# Altium schematic sheet POWER SUPPLY.SchDoc
size A4
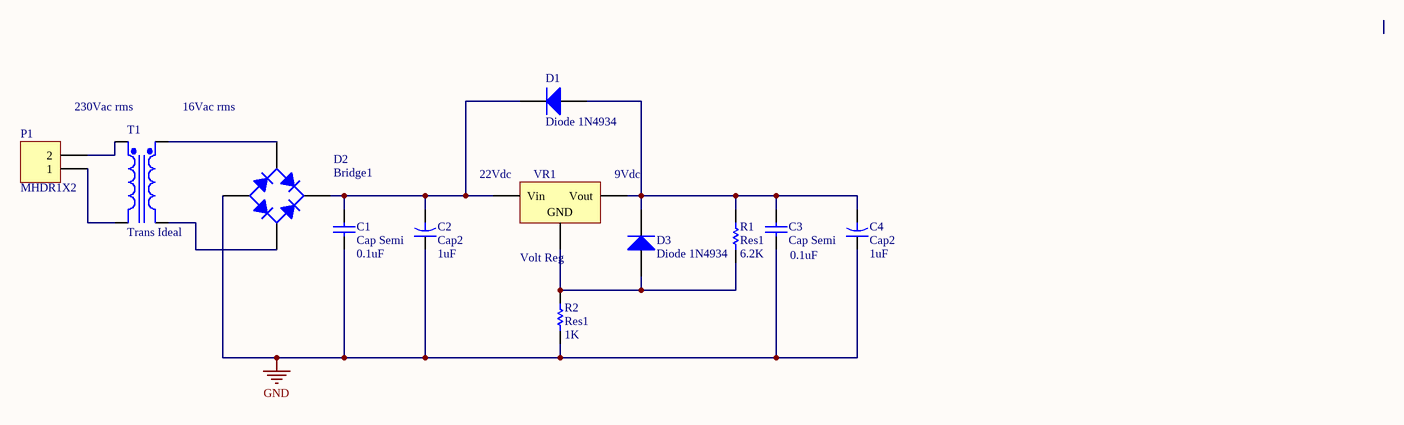
[diagram p0: POWER SUPPLY.SchDoc]

## Parts
C1  Cap Semi  value 0.1uF  [C1206]
C2  Cap2  value 1uF  [CAPR5-4X5]
C3  Cap Semi  value 0.1uF  [C1206]
C4  Cap2  value 1uF  [CAPR5-4X5]
D1  Diode 1N4934  [DO-41]
D2  Bridge1  [D-38]
D3  Diode 1N4934  [DO-41]
P1  MHDR1X2  [MHDR1X2]
R1  Res1  value 6.2K  [AXIAL-0.3]
R2  Res1  value 1K  [AXIAL-0.3]
T1  Trans Ideal  [TRF_4]
VR1  Volt Reg  [D2PAK_N]

## Nets
GND: C1.1 C2.1 C3.1 C4.1 D2.3(A) R2.1
NetC1_2: C1.2 C2.2 D1.2(K) D2.1(K) VR1.1(Vin)
NetC3_2: C3.2 C4.2 D1.1(A) D3.2(K) R1.1 VR1.3(Vout)
NetD2_2: D2.2(C) T1.4(Sec-)
NetD2_4: D2.4(C) T1.3(Sec+)
NetD3_1: D3.1(A) R1.2 R2.2 VR1.2(GND)
NetP1_1: P1.1 T1.2(Pri-)
NetP1_2: P1.2 T1.1(Pri+)

## Notes on the sheet
- 230Vac rms
- 16Vac rms
- (near VR1) 22Vdc
- (near VR1) 9Vdc

## Library data of the parts
C1 C3 = Cap Semi: Capacitor (Semiconductor SIM Model); Published: 8-Jun-2000; LatestRevisionDate: 29-May-2009; LatestRevisionNote: IPC-7351 Footprint Added.; PackageReference: C1206; Publisher: Altium Limited; PackageDescription: Chip Capacitor
C2 C4 = Cap2: Capacitor; Published: 23-Sep-2002; PackageReference: CAPR5-4X5; Publisher: Altium Limited; PackageDescription: Capacitor; 2 Leads
D1 D3 = Diode 1N4934: 1 Amp Fast Recovery Rectifier; Published: 8-Jun-2000; LatestRevisionDate: 17-Jul-2002; LatestRevisionNote: Re-released for DXP Platform.; DatasheetVersion: 1999; PackageVersion: Aug-1999; PackageReference: DO-41; Publisher: Altium Limited; PackageDescription: Diode, Axial; Body 5.2 x 2.7 mm (LxDia. max), Lead Dia. 0.86 mm (max); Code_JEDEC: DO-204-AL; ComponentLink1Description: Manufacturer Link; ComponentLink1URL: http://www.fairchildsemi.com/; ComponentLink2Description: Datasheet; ComponentLink2URL: http://www.fairchildsemi.com/ds/1N%2F1N4934.pdf
D2 = Bridge1: Full Wave Diode Bridge; Published: 8-Jun-2000; LatestRevisionDate: 29-May-2009; LatestRevisionNote: Sch pins A & K swapped.; DatasheetVersion: E2732B; PackageReference: D-38; Publisher: Altium Limited; PackageDescription: Bridge Rectifier; 4 Terminals; Body 9.4 x 9.4 mm (typ); Pitch 5.08 mm
P1 = MHDR1X2: Header, 2-Pin; LatestRevisionDate: 17-Jul-2002; LatestRevisionNote: Re-released for DXP Platform.; Publisher: Altium Limited
R1 R2 = Res1: Resistor; Published: 8-Jun-2000; LatestRevisionDate: 17-Jul-2002; LatestRevisionNote: Re-released for DXP Platform.; PackageReference: AXIAL-0.3; Publisher: Altium Limited; PackageDescription: Axial Device, Thru-Hole; 2 Leads; 0.3 in Pin Spacing
T1 = Trans Ideal: Transformer (Ideal); Published: 8-Jun-2000; LatestRevisionDate: 17-Jul-2002; LatestRevisionNote: Re-released for DXP Platform.; PackageReference: TRF_4; Publisher: Altium Limited; PackageDescription: Transformer; 4 Leads
VR1 = Volt Reg: Voltage Regulator; Published: 24-Mar-1999; LatestRevisionDate: 29-May-2009; LatestRevisionNote: IPC-7351 Footprint Added.; PackageReference: D2PAK; Publisher: Altium Limited; PackageDescription: 3-Pin Transistor Outline Package 2.54 mm Pitch, 15.1 mm Lead Span